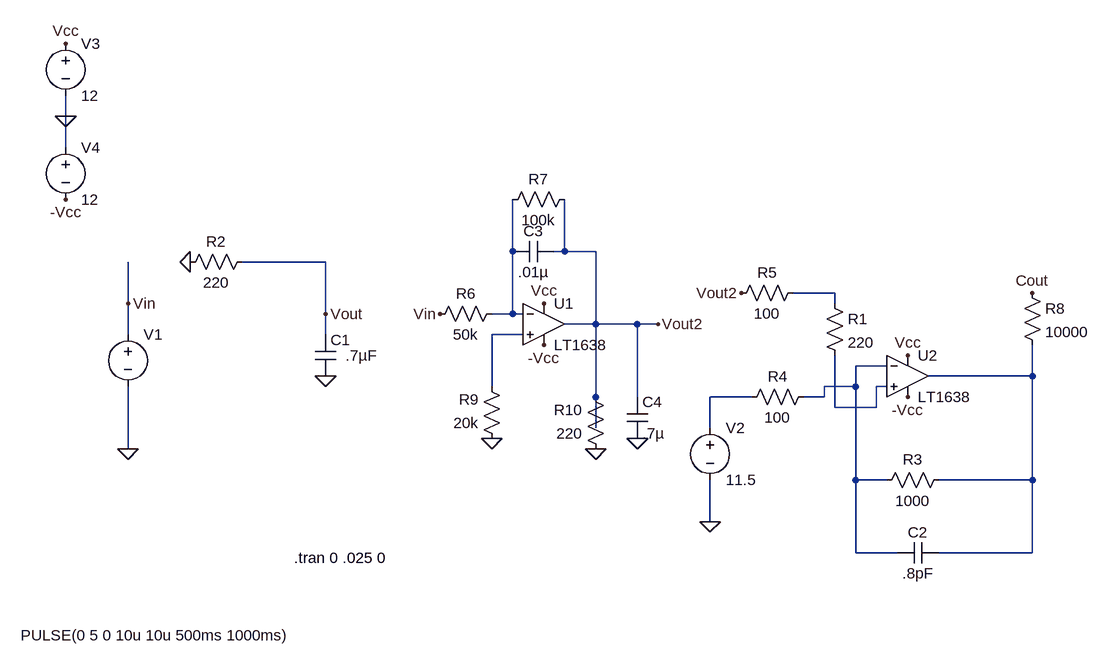
[diagram p0: schematic Low_pass_filter_comp_mel.asc]
Low_pass_filter_comp_mel.asc, the LTspice schematic file:
Version 4
SHEET 1 1848 680
WIRE -576 -352 -576 -384
WIRE -576 -304 -576 -352
WIRE 112 -144 112 -224
WIRE 192 -144 192 -224
WIRE 192 -144 176 -144
WIRE 240 -144 192 -144
WIRE -176 -128 -304 -128
WIRE 608 -80 544 -80
WIRE -480 -64 -480 -128
WIRE 608 -64 608 -80
WIRE -176 -48 -176 -128
WIRE 112 -48 112 -144
WIRE 112 -48 80 -48
WIRE 128 -48 112 -48
WIRE 240 -32 240 -144
WIRE 240 -32 192 -32
WIRE 304 -32 240 -32
WIRE 336 -32 304 -32
WIRE -480 -16 -480 -64
WIRE -176 -16 -176 -48
WIRE 128 -16 80 -16
WIRE 688 32 640 32
WIRE 912 48 912 0
WIRE 912 48 752 48
WIRE 80 64 80 -16
WIRE 640 64 640 32
WIRE 640 64 592 64
WIRE 688 64 672 64
WIRE 240 80 240 -32
WIRE 304 80 304 -32
WIRE 480 80 416 80
WIRE 592 80 592 64
WIRE 592 80 560 80
WIRE 608 96 608 16
WIRE 672 96 672 64
WIRE 672 96 608 96
WIRE 240 128 240 80
WIRE 416 128 416 80
WIRE -480 160 -480 64
WIRE 640 208 640 64
WIRE 688 208 640 208
WIRE 912 208 912 48
WIRE 912 208 768 208
WIRE 416 272 416 208
WIRE 640 320 640 208
WIRE 704 320 640 320
WIRE 912 320 912 208
WIRE 912 320 768 320
FLAG -480 160 0
FLAG -480 -64 Vin
FLAG -176 -48 Vout
FLAG -576 -352 0
FLAG -576 -464 Vcc
FLAG -576 -224 -Vcc
FLAG 720 16 Vcc
FLAG 720 80 -Vcc
FLAG 416 272 0
FLAG -176 48 0
FLAG 912 -80 Cout
FLAG 240 160 0
FLAG 304 144 0
FLAG 80 144 0
FLAG 336 -32 Vout2
FLAG 464 -80 Vout2
FLAG 160 -64 Vcc
FLAG 160 0 -Vcc
FLAG 0 -48 Vin
FLAG -384 -128 0
SYMBOL voltage -480 -32 R0
WINDOW 3 -165 479 Left 2
WINDOW 123 0 0 Left 0
WINDOW 39 0 0 Left 0
SYMATTR Value PULSE(0 5 0 10u 10u 500ms 1000ms)
SYMATTR InstName V1
SYMBOL cap -192 -16 R0
WINDOW 3 47 32 Left 2
SYMATTR Value .7µF
SYMATTR InstName C1
SYMBOL voltage -576 -480 R0
WINDOW 123 0 0 Left 0
WINDOW 39 0 0 Left 0
SYMATTR InstName V3
SYMATTR Value 12
SYMBOL voltage -576 -320 R0
WINDOW 123 0 0 Left 0
WINDOW 39 0 0 Left 0
SYMATTR InstName V4
SYMATTR Value 12
SYMBOL res 784 192 R90
WINDOW 0 0 56 VBottom 2
WINDOW 3 32 56 VTop 2
SYMATTR InstName R3
SYMATTR Value 1000
SYMBOL res 576 64 R90
WINDOW 0 0 56 VBottom 2
WINDOW 3 32 56 VTop 2
SYMATTR InstName R4
SYMATTR Value 100
SYMBOL res 592 -80 R0
SYMATTR InstName R1
SYMATTR Value 220
SYMBOL res 560 -96 R90
WINDOW 0 0 56 VBottom 2
WINDOW 3 32 56 VTop 2
SYMATTR InstName R5
SYMATTR Value 100
SYMBOL cap 768 304 R90
WINDOW 0 0 32 VBottom 2
WINDOW 3 32 32 VTop 2
SYMATTR InstName C2
SYMATTR Value .8pF
SYMBOL OpAmps\\LT1638 720 -16 R0
SYMATTR InstName U2
SYMBOL voltage 416 112 R0
WINDOW 123 0 0 Left 0
WINDOW 39 0 0 Left 0
SYMATTR InstName V2
SYMATTR Value 11.5
SYMBOL res -288 -144 R90
WINDOW 0 0 56 VBottom 2
WINDOW 3 32 56 VTop 2
SYMATTR InstName R2
SYMATTR Value 220
SYMBOL res 896 -96 R0
SYMATTR InstName R8
SYMATTR Value 10000
SYMBOL res 96 -64 R90
WINDOW 0 0 56 VBottom 2
WINDOW 3 32 56 VTop 2
SYMATTR InstName R6
SYMATTR Value 50k
SYMBOL res 208 -240 R90
WINDOW 0 0 56 VBottom 2
WINDOW 3 32 56 VTop 2
SYMATTR InstName R7
SYMATTR Value 100k
SYMBOL res 96 160 R180
WINDOW 0 36 76 Left 2
WINDOW 3 36 40 Left 2
SYMATTR InstName R9
SYMATTR Value 20k
SYMBOL res 256 176 R180
WINDOW 0 36 76 Left 2
WINDOW 3 36 40 Left 2
SYMATTR InstName R10
SYMATTR Value 220
SYMBOL cap 176 -160 R90
WINDOW 0 0 32 VBottom 2
WINDOW 3 32 32 VTop 2
SYMATTR InstName C3
SYMATTR Value .01µ
SYMBOL cap 288 80 R0
SYMATTR InstName C4
SYMATTR Value .7µ
SYMBOL OpAmps\\LT1638 160 -96 R0
SYMATTR InstName U1
TEXT -224 328 Left 2 !.tran 0 .025 0

The netlist it stands for:
* Low_pass_filter_comp_mel.asc
V1 Vin 0 PULSE(0 5 0 10u 10u 500ms 1000ms)
C1 Vout 0 .7µF
V3 Vcc 0 12
V4 0 -Vcc 12
R3 N005 N004 1000
R4 N004 N007 100
R1 N002 N006 220
R5 N002 Vout2 100
C2 N005 N004 .8pF
XU2 N006 N004 Vcc -Vcc N005 LT1638  ; pins In+ In- V+ V- OUT
V2 N007 0 11.5
R2 Vout 0 220
R8 Cout N005 10000
R6 N001 Vin 50k
R7 Vout2 N001 100k
R9 0 N003 20k
R10 0 Vout2 220
C3 Vout2 N001 .01µ
C4 Vout2 0 .7µ
XU1 N003 N001 Vcc -Vcc Vout2 LT1638  ; pins In+ In- V+ V- OUT
.tran 0 .025 0
.backanno
.end